# Altium schematic sheet ISL6236A_DEMO.SchDoc
size A3
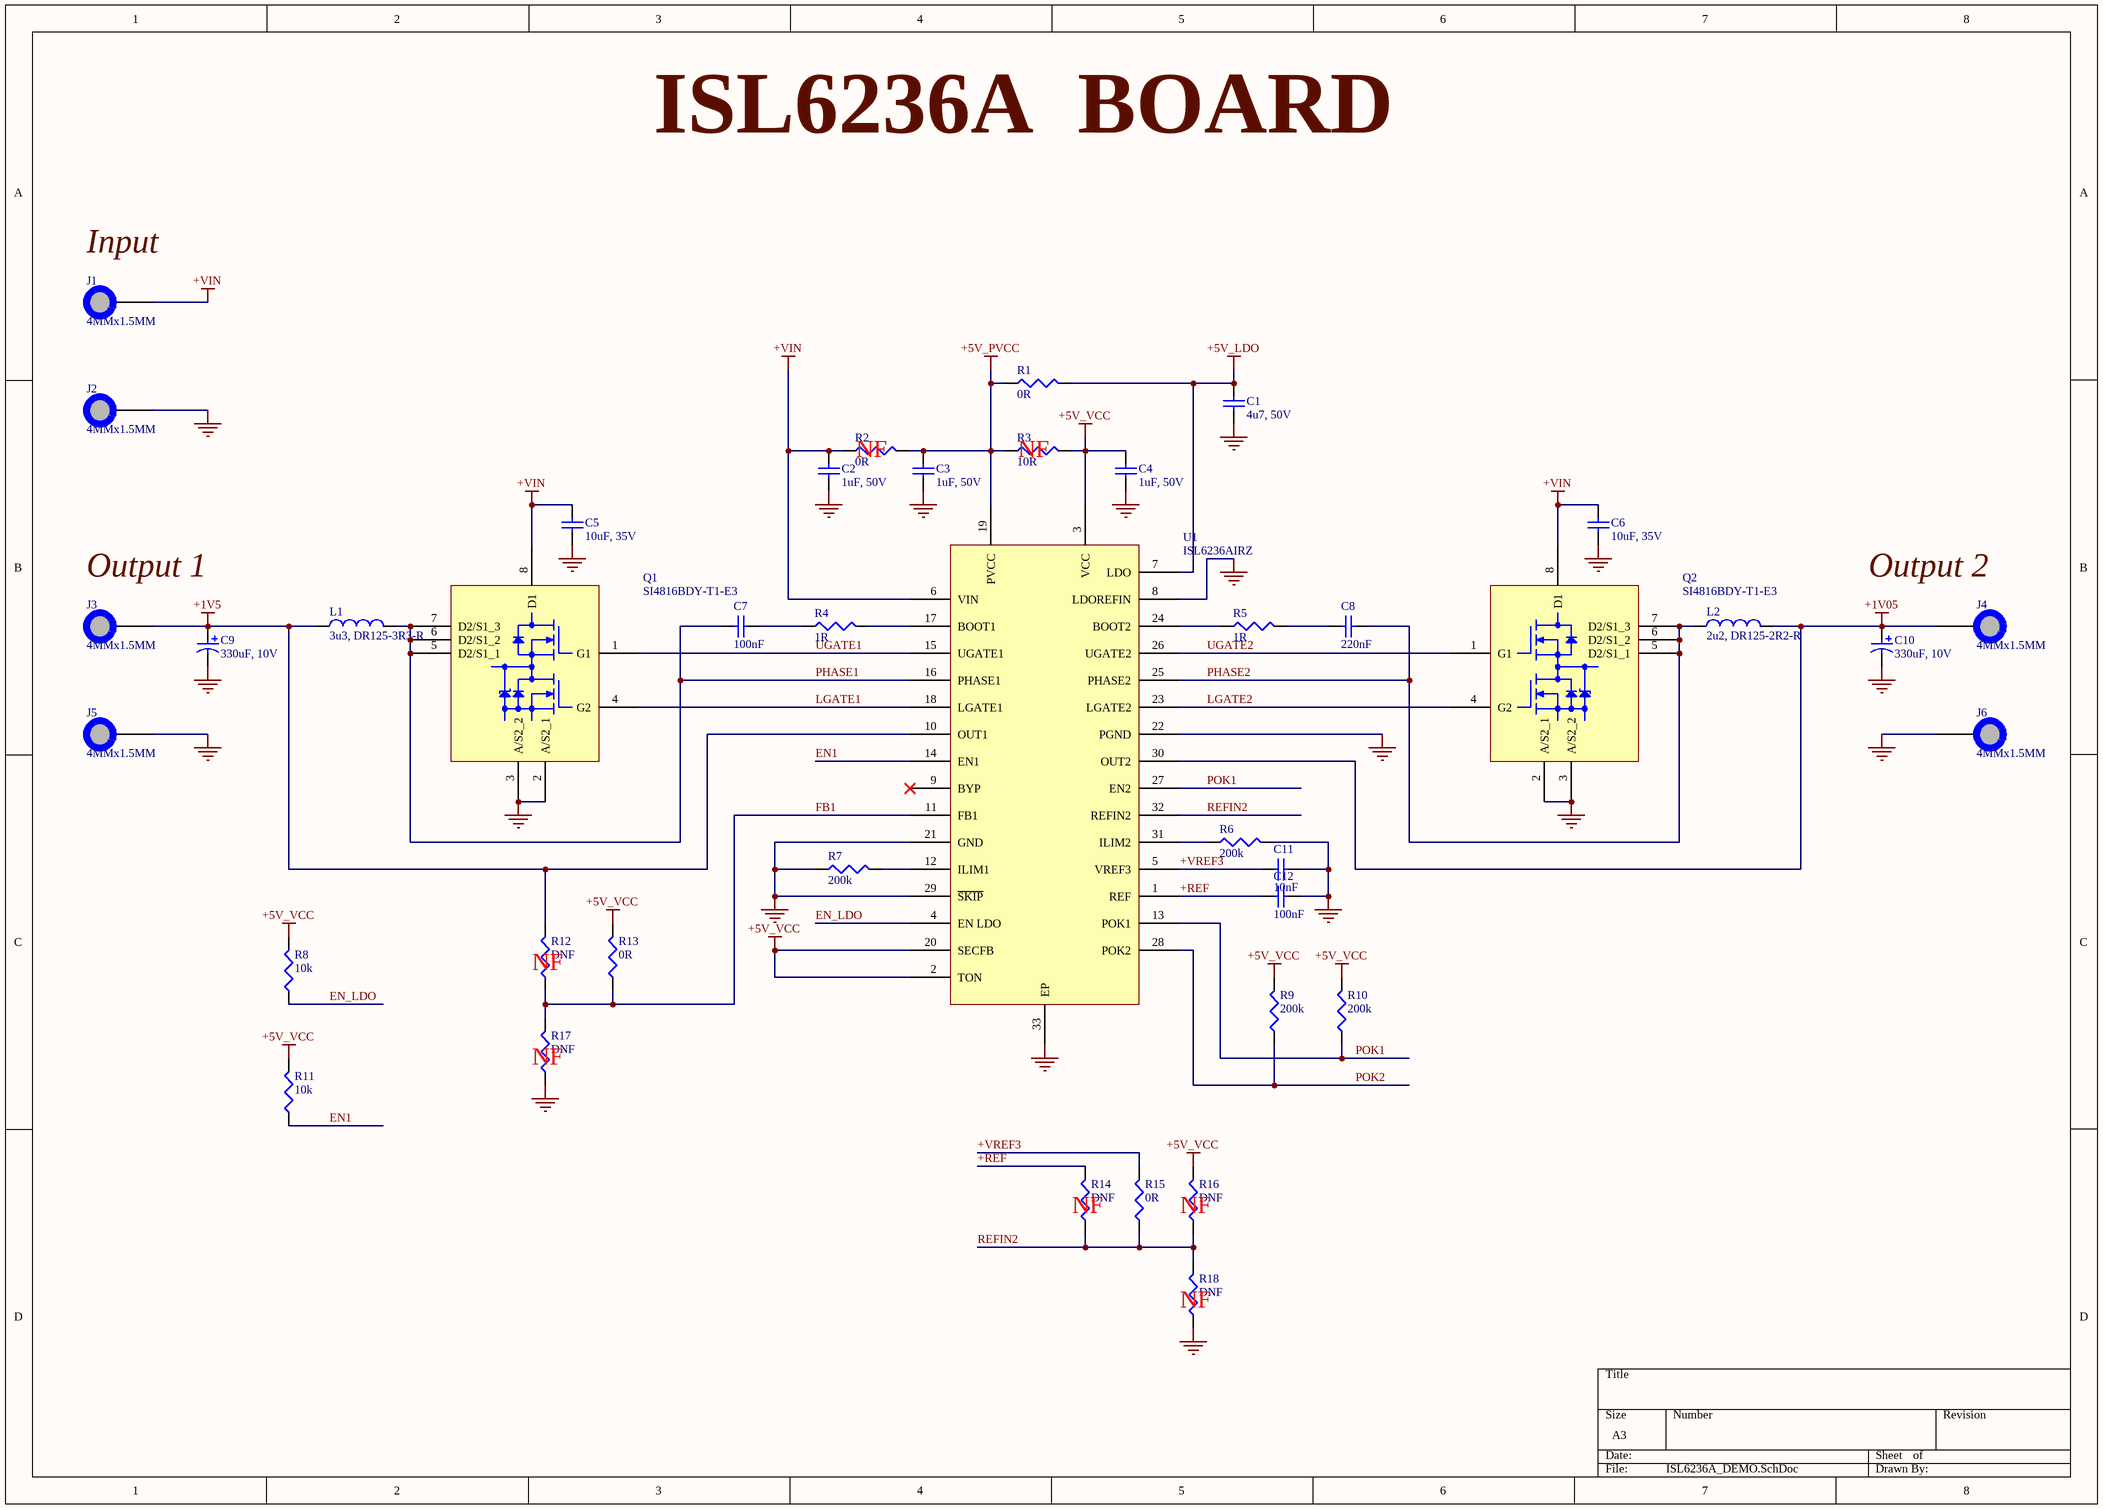
[diagram p0: ISL6236A_DEMO.SchDoc]

## Parts
C1  4u7, 50V  [C1206]
C2  1uF, 50V  [C0805]
C3  1uF, 50V  [C0805]
C4  1uF, 50V  [C0805]
C5  10uF, 35V  [C1210]
C6  10uF, 35V  [C1210]
C7  100nF  [C0805]
C8  220nF  [C0805]
C9  330uF, 10V  [7343-43]
C10  330uF, 10V  [7343-43]
C11  10nF  [C0805]
C12  100nF  [C0805]
J1  4MMx1.5MM  [PAD_WITH_HOLE_4MMx1MM5]
J2  4MMx1.5MM  [PAD_WITH_HOLE_4MMx1MM5]
J3  4MMx1.5MM  [PAD_WITH_HOLE_4MMx1MM5]
J4  4MMx1.5MM  [PAD_WITH_HOLE_4MMx1MM5]
J5  4MMx1.5MM  [PAD_WITH_HOLE_4MMx1MM5]
J6  4MMx1.5MM  [PAD_WITH_HOLE_4MMx1MM5]
L1  3u3, DR125-3R3-R  [DR125]
L2  2u2, DR125-2R2-R  [DR125]
Q1  SI4816BDY-T1-E3  [SO-8]
Q2  SI4816BDY-T1-E3  [SO-8]
R1  0R  [R0805]
R2  0R  [R0805]
R3  10R  [R0805]
R4  1R  [R0805]
R5  1R  [R0805]
R6  200k  [R0805]
R7  200k  [R0805]
R8  10k  [R0805]
R9  200k  [R0805]
R10  200k  [R0805]
R11  10k  [R0805]
R12  DNF  [R0805]
R13  0R  [R0805]
R14  DNF  [R0805]
R15  0R  [R0805]
R16  DNF  [R0805]
R17  DNF  [R0805]
R18  DNF  [R0805]
U1  ISL6236AIRZ  [L32.5x5B]

## Nets
+1V5: C9.1 J3.1 L1.1 R12.2 U1.10(OUT1)
+1V05: C10.1 J4.1 L2.2 U1.30(OUT2)
+5V_LDO: C1.2 R1.2 U1.7(LDO)
+5V_PVCC: C3.2 R1.1 R2.2 R3.1 U1.19(PVCC)
+5V_VCC: C4.2 R3.2 R8.2 R9.2 R10.2 R11.2 R13.2 R16.2 U1.2(TON) U1.3(VCC) U1.20(SECFB)
+VIN: C2.2 C5.2 C6.2 J1.1 Q1.8(D1) Q2.8(D1) R2.1 U1.6(VIN)
GND: C1.1 C2.1 C3.1 C4.1 C5.1 C6.1 C9.2 C10.2 C11.2 C12.2 J2.1 J5.1 J6.1 Q1.2(A/S2_1) Q1.3(A/S2_2) Q2.2(A/S2_1) Q2.3(A/S2_2) R6.2 R7.1 R17.1 R18.1 U1.8(LDOREFIN) U1.21(GND) U1.22(PGND) U1.29(~{SKIP}) U1.33(EP)
+REF: C12.1 R14.2 U1.1(REF)
+VREF3: C11.1 R15.2 U1.5(VREF3)
EN1: R11.1 U1.14(EN1)
EN_LDO: R8.1 U1.4(EN_LDO)
FB1: R12.1 R13.1 R17.2 U1.11(FB1)
LGATE1: Q1.4(G2) U1.18(LGATE1)
LGATE2: Q2.4(G2) U1.23(LGATE2)
PHASE1: C7.1 L1.2 Q1.5(D2/S1_1) Q1.6(D2/S1_2) Q1.7(D2/S1_3) U1.16(PHASE1)
PHASE2: C8.2 L2.1 Q2.5(D2/S1_1) Q2.6(D2/S1_2) Q2.7(D2/S1_3) U1.25(PHASE2)
POK1: R10.1 U1.13(POK1) U1.27(EN2)
POK2: R9.1 U1.28(POK2)
REFIN2: R14.1 R15.1 R16.1 R18.2 U1.32(REFIN2)
UGATE1: Q1.1(G1) U1.15(UGATE1)
UGATE2: Q2.1(G1) U1.26(UGATE2)
NetC7_2: C7.2 R4.1
NetC8_1: C8.1 R5.2
NetR4_2: R4.2 U1.17(BOOT1)
NetR5_1: R5.1 U1.24(BOOT2)
NetR6_1: R6.1 U1.31(ILIM2)
NetR7_2: R7.2 U1.12(ILIM1)

Not connected (* = marked no-connect by the designer): U1 9(BYP)*

## Notes on the sheet
- ISL6236A  BOARD
- (near J1) Input
- (near R2) NF
- (near R3) NF
- Output 1
- Output 2
- (near R12) NF
- (near R17) NF
- (near R14) NF
- (near R16) NF
- (near R18) NF

## Library data of the parts
C1 = C3216X5R1H475K160AB: CAP CER 4.7UF 50V X5R 1206; Manufacturer: TDK; Dielectric Material: Ceramic; Tolerance: 10%; Supplier 1: Digi-Key; Manufacturer Part Number: C3216X5R1H475K160AB; RoHS: Yes; Stock 1: 5017; Pricing 1: 1 = 1.02000, 10 = 0.75500, 100 = 0.51750, 500 = 0.40968, 1000 = 0.34500 (USD); Mount: Surface Mount; Case/Package: 1206; Weight: 0.000571oz; Case Code (Imperial): 1206; Case Code (Metric): 3216; Min Operating Temperature: -55°C; Max Operating Temperature: 85°C; Capacitance: 4.7uF; Packaging: Tape and Reel; Voltage Rating: 50V; Voltage Rating (DC): 50V; Package Quantity: 1; Dielectric: X5R; Termination: SMD/SMT; Composition: Ceramic; Length: 3.2mm; Height: 1.6mm; Width: 1.6mm; Thickness: 0.071inch; Depth: 1.6mm; Lead Free: Lead Free; ComponentLink1URL: http://www.mouser.com/ds/2/400/lcc_commercial_general_en-837201.pdf; ComponentLink1Description: http://www.mouser.com/ds/2/400/lcc_commercial_general_en-837201.pdf; ComponentLink2URL: https://product.tdk.com/en/products/common/pdf/mlcc_partnumber_description.pdf; ComponentLink2Description: https://product.tdk.com/en/products/common/pdf/mlcc_partnumber_description.pdf; ComponentLink3URL: https://product.tdk.com/info/en/documents/chara_sheet/C3216X5R1H475K160AB.pdf; ComponentLink3Description: https://product.tdk.com/info/en/documents/chara_sheet/C3216X5R1H475K160AB.pdf; Supplier Part Number 1: 445-5994-1-ND
C2-C4 = C0805C105K5RACTU: Multilayer Ceramic Capacitors MLCC - SMD/SMT 1uF 50 Volts 10% X7R; Manufacturer: KEMET; Supplier 1: Digi-Key; Manufacturer Part Number: C0805C105K5RACTU; RoHS: Yes; Stock 1: 58300; Pricing 1: 1 = 0.45000, 10 = 0.31500, 100 = 0.18890, 500 = 0.14166, 1000 = 0.11963 (USD); Mount: PCB,Surface Mount; Case/Package: 0805; Case Code (Metric): 2012; Case Code (Imperial): 0805; Contact Plating: Matte,Tin; Dielectric Material: Ceramic; Min Operating Temperature: -55°C; Max Operating Temperature: 125°C; Packaging: Tape and Reel; Capacitance: 1uF; Tolerance: 10%; Voltage Rating: 50V; Voltage Rating (DC): 50V; Package Quantity: 1; Dielectric: X7R; Termination: SMD/SMT; Voltage: 50V; Length: 2mm; Height: 1.25mm; Width: 0.049inch; Thickness: 0.055inch; Depth: 1.25mm; REACH SVHC: No SVHC; ComponentLink1URL: http://www.farnell.com/datasheets/1851736.pdf; ComponentLink1Description: http://www.farnell.com/datasheets/1851736.pdf; ComponentLink2URL: http://www.mouser.com/ds/2/212/KEM_C1002_X7R_SMD-1102033.pdf; ComponentLink2Description: http://www.mouser.com/ds/2/212/KEM_C1002_X7R_SMD-1102033.pdf; Supplier Part Number 1: 399-7409-1-ND
C5 C6 = C1210C106K6PACTU: 1210 C 10uF Ceramic Multilayer Capacitor,  35 VDC,  +85degC,  X5R Dielec,  +/-10%; Manufacturer: KEMET; Dissipation Factor: 2.5%; Tolerance: 10%; Supplier 1: Digi-Key; Manufacturer Part Number: C1210C106K6PACTU; RoHS: Yes; Stock 1: 752; Pricing 1: 1 = 0.93000, 10 = 0.68600, 100 = 0.47030, 500 = 0.37228, 1000 = 0.31350 (USD); Mount: Surface Mount; Case/Package: 1210; Case Code (Metric): 3225; Case Code (Imperial): 1210; Dielectric Material: Ceramic; Min Operating Temperature: -55°C; Max Operating Temperature: 85°C; Packaging: Tape and Reel; Capacitance: 10uF; Voltage Rating: 35V; Voltage: 35V; Dielectric: X5R; Termination: Solder; Voltage Rating (DC): 35V; Length: 0.126inch; Height: 1.9mm; Width: 0.098inch; Thickness: 0.083inch; Depth: 2.5mm; Lead Free: Lead Free; Supplier Part Number 1: 399-12070-1-ND
C7 C12 = C0805C104K5RAC7800: Multilayer Ceramic Capacitors MLCC - SMD/SMT 50volts 0.1uF X7R 10%; Manufacturer: KEMET; Voltage Rating (DC): 50V; Supplier 1: Digi-Key; Manufacturer Part Number: C0805C104K5RAC7800; RoHS: Yes; Stock 1: 310062; Pricing 1: 1 = 0.24000, 10 = 0.17300, 100 = 0.08130, 500 = 0.05700, 1000 = 0.04719 (USD); Mount: Surface Mount; Case/Package: 0805; Case Code (Imperial): 0805; Case Code (Metric): 2012; Min Operating Temperature: -55°C; Max Operating Temperature: 125°C; Packaging: Tape and Reel; Tolerance: 10%; Capacitance: 100nF; Dielectric: X7R; Termination: SMD/SMT; Voltage: 50V; Package Quantity: 4000; Voltage Rating: 50V; Length: 2mm; Height: 0.9mm; Width: 1.2mm; Lead Pitch: 0.75mm; Depth: 1.25mm; Radiation Hardening: No; ComponentLink1URL: http://www.mouser.com/ds/2/212/KEM_C1002_X7R_SMD-1102033.pdf; ComponentLink1Description: http://www.mouser.com/ds/2/212/KEM_C1002_X7R_SMD-1102033.pdf; ComponentLink2URL: https://www.distrelec.biz/Web/Downloads/_t/ds/KEM_C1002_X7R_SMD_eng_tds.pdf?mime=application%2Fpdf; ComponentLink2Description: https://www.distrelec.biz/Web/Downloads/_t/ds/KEM_C1002_X7R_SMD_eng_tds.pdf?mime=application%2Fpdf; Supplier Part Number 1: 399-1170-1-ND
C8 = C0805C224K5RACTU: CAP CER 0.22UF 50V X7R 0805; Manufacturer: KEMET; Dielectric Material: Ceramic; Tolerance: 10%; Dissipation Factor: 2.5%; Supplier 1: Digi-Key; Manufacturer Part Number: C0805C224K5RACTU; RoHS: Yes; Stock 1: 1343663; Pricing 1: 1 = 0.22000, 10 = 0.15800, 100 = 0.07440, 500 = 0.05220, 1000 = 0.04321 (USD); Mount: PCB,Surface Mount; Case/Package: 0805; Case Code (Metric): 2012; Case Code (Imperial): 0805; Min Operating Temperature: -55°C; Max Operating Temperature: 125°C; Package Quantity: 1; Capacitance: 220nF; Voltage Rating: 50V; Packaging: Tape and Reel; Voltage Rating (DC): 50V; Dielectric: X7R; Termination: SMD/SMT; Voltage: 50V; Length: 2mm; Height: 0.9mm; Width: 0.049inch; Thickness: 0.055inch; Lead Pitch: 0.75mm; Depth: 1.25mm; Radiation Hardening: No; REACH SVHC: No SVHC; ComponentLink1URL: http://www.kemet.com/kemet/web/homepage/kechome.nsf/vapubfiles/KEM_C1002_X7R_SMD.pdf/$file/KEM_C1002_X7R_SMD.pdf; ComponentLink1Description: http://www.kemet.com/kemet/web/homepage/kechome.nsf/vapubfiles/KEM_C1002_X7R_SMD.pdf/$file/KEM_C1002_X7R_SMD.pdf; ComponentLink2URL: https://www.verical.com/server-webapp/html/getDatasheet?partID=304413; ComponentLink2Description: https://www.verical.com/server-webapp/html/getDatasheet?partID=304413; ComponentLink3URL: http://www.farnell.com/datasheets/1851736.pdf; ComponentLink3Description: http://www.farnell.com/datasheets/1851736.pdf; ComponentLink4URL: https://search.kemet.com/component-edge/download/datasheet/C0805C224K5RACTU.pdf; ComponentLink4Description: https://search.kemet.com/component-edge/download/datasheet/C0805C224K5RACTU.pdf; Supplier Part Number 1: 399-3491-1-ND
C9 C10 = T530X337M010ATE004: Tantalum Capacitors - Polymer SMD 330uF 10volts 20%; Manufacturer: KEMET; Ripple Current: 8.2A; ESR (Equivalent Series Resistance): 4mR; Leakage Current: 330uA; Polarity: Polar; Dissipation Factor: 8%; Life (Hours): 2000Hour; Supplier 1: Digi-Key; Manufacturer Part Number: T530X337M010ATE004; RoHS: Yes; Pricing 1: 1 = 6.86000, 10 = 6.09500, 100 = 4.87600 (USD); Mount: PCB,Surface Mount; Case/Package: 2917; Case Code (Imperial): 2917; Case Code (Metric): 7343; Min Operating Temperature: -55°C; Max Operating Temperature: 125°C; Package Quantity: 500; Voltage Rating (DC): 10V; Capacitance: 330uF; Tolerance: 20%; Packaging: Tape and Reel; Voltage Rating: 10V; Termination: SMD/SMT; Voltage: 10V; Features: General Purpose; Length: 7.3mm; Height: 4mm; Width: 4.3mm; Height - Seated (Max): 0.169inch; Depth: 4.3mm; REACH SVHC: No SVHC; ComponentLink1URL: https://www.alliedelec.com/m/d/c2b5846d1b4015924ec44504ba06510b.pdf; ComponentLink1Description: https://www.alliedelec.com/m/d/c2b5846d1b4015924ec44504ba06510b.pdf; ComponentLink2URL: http://uk.rs-online.com/webdocs/1529/0900766b815291cb.pdf; ComponentLink2Description: http://uk.rs-online.com/webdocs/1529/0900766b815291cb.pdf; Supplier Part Number 1: 399-10378-1-ND
C11 = C0805F103K5RACTU: CAP CER 10000PF 50V X7R 0805; Manufacturer: KEMET; Dielectric Material: Ceramic; Tolerance: 10%; Supplier 1: Digi-Key; Manufacturer Part Number: C0805F103K5RACTU; RoHS: Yes; Stock 1: 75209; Pricing 1: 1 = 0.39000, 10 = 0.27000, 100 = 0.16190, 500 = 0.12142, 1000 = 0.10253 (USD); Mount: Surface Mount; Case/Package: 0805; Number of Pins: 2; Case Code (Imperial): 0805; Case Code (Metric): 2012; Min Operating Temperature: -55°C; Max Operating Temperature: 125°C; Capacitance: 10nF; Package Quantity: 4000; Voltage Rating: 50V; Voltage Rating (DC): 50V; Packaging: Cut Tape; Dielectric: X7R; Termination: SMD/SMT; Voltage: 50V; Length: 2mm; Height: 0.9mm; Width: 1.25mm; Lead Pitch: 0.75mm; Thickness: 0.039inch; Depth: 1.25mm; REACH SVHC: No SVHC; ComponentLink1URL: https://search.kemet.com/component-edge/download/datasheet/C0805F103K5RACTU.pdf; ComponentLink1Description: https://search.kemet.com/component-edge/download/datasheet/C0805F103K5RACTU.pdf; ComponentLink2URL: http://www.farnell.com/datasheets/2317279.pdf; ComponentLink2Description: http://www.farnell.com/datasheets/2317279.pdf; Supplier Part Number 1: 399-5107-1-ND
J1-J6 = PAD_WITH_HOLE_4MMx1MM5: Pad with a hole 4mm x 1.5mm
L1 = DR125-3R3-R: Inductor Power Shielded Drum Core 3.084uH/3.3uH 20% 100KHz Ferrite 9.26A 6.3mOhm DCR T/R; Manufacturer: Eaton Cooper; Saturation Current: 12.7A; Inductance: 3.3uh; DC Resistance (DCR): 6.3mR; Supplier 1: Digi-Key; Manufacturer Part Number: DR125-3R3-R; RoHS: Yes; Stock 1: 3434; Pricing 1: 1 = 2.03000, 10 = 1.87300, 100 = 1.31130 (USD); Mount: Surface Mount; Case/Package: Nonstandard; Number of Pins: 2; Core Material: Ferrite; Min Operating Temperature: -40°C; Max Operating Temperature: 125°C; Tolerance: 20%; Shielding: Shielded; Packaging: Tape and Reel; Inductance Tolerance: 20%; Package Quantity: 600; Test Frequency: 100kHz; Max DC Current: 9.26A; Termination: SMD/SMT; RMS Current (Irms): 9.26A; Self Resonant Frequency: 100kHz; Military Standard: Not; Current Rating: 9.26A; Composition: Wirewound; Length: 12.5mm; Height: 6mm; Width: 0.492inch; Depth: 12.5mm; Height - Seated (Max): 0.236inch; Radiation Hardening: No; REACH SVHC: No SVHC; ComponentLink1URL: http://uk.rs-online.com/webdocs/116a/0900766b8116a153.pdf; ComponentLink1Description: http://uk.rs-online.com/webdocs/116a/0900766b8116a153.pdf; ComponentLink2URL: https://www.verical.com/server-webapp/html/getDatasheet?partID=251124; ComponentLink2Description: https://www.verical.com/server-webapp/html/getDatasheet?partID=251124; ComponentLink3URL: http://www.farnell.com/datasheets/87246.pdf; ComponentLink3Description: http://www.farnell.com/datasheets/87246.pdf; ComponentLink4URL: http://www.cooperindustries.com/content/dam/public/bussmann/Electronics/Resources/product-datasheets/Bus_Elx_DS_4315_DR_Series.pdf; ComponentLink4Description: http://www.cooperindustries.com/content/dam/public/bussmann/Electronics/Resources/product-datasheets/Bus_Elx_DS_4315_DR_Series.pdf; ComponentLink5URL: http://www.onlinecomponents.com/productFiles/mf-COI/4a32919a-7470-4ae0-be45-b59e3a1351ef.pdf; ComponentLink5Description: http://www.onlinecomponents.com/productFiles/mf-COI/4a32919a-7470-4ae0-be45-b59e3a1351ef.pdf; Supplier Part Number 1: 513-1529-1-ND
L2 = DR125-2R2-R: Fixed Inductors 2.2uH 15A 0.0045ohms; Manufacturer: Eaton Cooper; Core Material: Ferrite; Current Rating: 10.9A; Tolerance: 20%; Shielding: Shielded; DC Resistance (DCR): 4.5mR; Test Frequency: 100kHz; Supplier 1: Digi-Key; Manufacturer Part Number: DR125-2R2-R; RoHS: Yes; Stock 1: 105; Pricing 1: 1 = 2.03000, 10 = 1.87300, 100 = 1.31130 (USD); Mount: Surface Mount; Case/Package: Nonstandard; Number of Pins: 2; Weight: 0.144oz; Min Operating Temperature: -40°C; Max Operating Temperature: 125°C; Package Quantity: 600; Saturation Current: 15A; Packaging: Tape and Reel; Inductance: 2.2uh; Inductance Tolerance: 20%; Composition: Wirewound; Max DC Current: 10.9A; Termination: SMD/SMT; Self Resonant Frequency: 100kHz; DC Current: 10.9A; Military Standard: Not; RMS Current (Irms): 10.9A; Length: 12.5mm; Height: 6mm; Width: 0.492inch; Height - Seated (Max): 0.236inch; Depth: 12.5mm; Radiation Hardening: No; REACH SVHC: No SVHC; Lead Free: Lead Free; ComponentLink1URL: https://www.verical.com/server-webapp/html/getDatasheet?partID=571249; ComponentLink1Description: https://www.verical.com/server-webapp/html/getDatasheet?partID=571249; ComponentLink2URL: http://uk.rs-online.com/webdocs/116a/0900766b8116a153.pdf; ComponentLink2Description: http://uk.rs-online.com/webdocs/116a/0900766b8116a153.pdf; ComponentLink3URL: http://www.farnell.com/datasheets/87246.pdf; ComponentLink3Description: http://www.farnell.com/datasheets/87246.pdf; Supplier Part Number 1: 513-1662-1-ND
Q1 Q2 = SI4816BDY-T1-E3: MOSFET 2N-CH 30V 5.8A 8-SOIC; Manufacturer: Vishay Siliconix; Nominal Vgs: 3V; Rise Time: 9ns; Rds On Max: 18.5mR; Number of Elements: 2; Continuous Drain Current (ID): 8.2A; Drain to Source Resistance: 11.5mR; Gate to Source Voltage (Vgs): 20V; Max Power Dissipation: 1.25W; Turn-Off Delay Time: 31ns; Turn-On Delay Time: 13ns; Threshold Voltage: 1V; Element Configuration: Single; FET Type: 2 N-Channel; Supplier 1: Digi-Key; Manufacturer Part Number: SI4816BDY-T1-E3; RoHS: Yes; Stock 1: 7400; Pricing 1: 1 = 1.86000, 10 = 1.68100, 100 = 1.35110, 500 = 1.05086, 1000 = 0.87071 (USD); Mount: Surface Mount; Case/Package: SO; Number of Pins: 8; Weight: 0.006596oz; Min Operating Temperature: -55°C; Max Operating Temperature: 150°C; Packaging: Tape and Reel; Package Quantity: 1; Drain to Source Voltage (Vdss): 30V; Fall Time: 9ns; Number of Channels: 2; On-State Resistance: 18.5mR; Length: 5mm; Height: 1.55mm; Width: 4mm; Radiation Hardening: No; REACH SVHC: Unknown; Lead Free: Lead Free; ComponentLink1URL: http://www.vishay.com/docs/73026/si4816bd.pdf; ComponentLink1Description: http://www.vishay.com/docs/73026/si4816bd.pdf; ComponentLink2URL: https://www.verical.com/server-webapp/html/getDatasheet?partID=99188; ComponentLink2Description: https://www.verical.com/server-webapp/html/getDatasheet?partID=99188; ComponentLink3URL: https://www.alliedelec.com/m/d/ccea3a815e37c52236fbabed3b2d7fee.pdf; ComponentLink3Description: https://www.alliedelec.com/m/d/ccea3a815e37c52236fbabed3b2d7fee.pdf; ComponentLink4URL: http://datasheet.iiic.cc/vishay_[siliconix]/SI4816BDY-T1-E3.pdf; ComponentLink4Description: http://datasheet.iiic.cc/vishay_[siliconix]/SI4816BDY-T1-E3.pdf; Supplier Part Number 1: SI4816BDY-T1-E3CT-ND
R1 R2 R13 R15 = AC0805JR-070RL: Thick Film Resistors - SMD 1/8W 0.0ohm 5%; Manufacturer: Yageo; Power Rating: 125mW; Voltage Rating: 150V; Resistance: 0mR; Temperature Coefficient: 200ppm/°C; Supplier 1: Digi-Key; Manufacturer Part Number: AC0805JR-070RL; RoHS: Yes; Stock 1: 291433; Pricing 1: 1 = 0.10000, 10 = 0.04500, 25 = 0.03240, 50 = 0.02480, 100 = 0.01820, 250 = 0.01392, 500 = 0.01112, 1000 = 0.00819 (USD); Case/Package: 0805; Case Code (Imperial): 0805; Case Code (Metric): 2012; Min Operating Temperature: -55°C; Max Operating Temperature: 155°C; Packaging: Tape and Reel; Tolerance: 5%; Composition: Thick Film; Termination: SMD/SMT; Number of Terminations: 2; Max Power Dissipation: 125mW; Features: Automotive AEC-Q200,Moisture Resistant; Length: 0.079inch; Height: 0.024inch; Width: 1.25mm; Lead Free: Lead Free; Supplier Part Number 1: YAG3755CT-ND
R3 = AC0805FR-0710RL: Thick Film Resistors - SMD 1/8W 10ohm 1%; Manufacturer: Yageo; Power Rating: 125mW; Voltage Rating: 150V; Temperature Coefficient: 200ppm/°C; Supplier 1: Digi-Key; Manufacturer Part Number: AC0805FR-0710RL; RoHS: Yes; Stock 1: 569278; Pricing 1: 1 = 0.10000, 10 = 0.09000, 100 = 0.03460, 1000 = 0.01522, 2500 = 0.01315 (USD); Case/Package: 0805; Case Code (Imperial): 0805; Case Code (Metric): 2012; Min Operating Temperature: -55°C; Max Operating Temperature: 155°C; Packaging: Tape and Reel; Resistance: 10R; Tolerance: 1%; Composition: Thick Film; Termination: SMD/SMT; Number of Terminations: 2; Military Standard: Not; Max Power Dissipation: 125mW; Features: Automotive AEC-Q200,Moisture Resistant; Length: 2mm; Height: 0.024inch; Width: 1.25mm; Depth: 1.25mm; Lead Free: Lead Free; Supplier Part Number 1: YAG3690CT-ND
R4 R5 = AC0805FR-071RL: Thick Film Resistors - SMD 1/8W 1ohm 1% AEC-Q200; Manufacturer: Yageo; Voltage Rating: 150V; Power Rating: 125mW; Temperature Coefficient: 200ppm/°C; Supplier 1: Digi-Key; Manufacturer Part Number: AC0805FR-071RL; RoHS: Yes; Stock 1: 34903; Pricing 1: 1 = 0.10000, 10 = 0.09000, 100 = 0.03460, 1000 = 0.01522, 2500 = 0.01315 (USD); Case/Package: 0805; Weight: 0.000194oz; Case Code (Imperial): 0805; Case Code (Metric): 2012; Min Operating Temperature: -55°C; Max Operating Temperature: 155°C; Packaging: Tape and Reel; Tolerance: 1%; Resistance: 1R; Composition: Thick Film; Number of Terminations: 2; Termination: SMD/SMT; Max Power Dissipation: 125mW; Features: Automotive AEC-Q200,Moisture Resistant; Length: 0.079inch; Height: 0.024inch; Width: 0.049inch; Lead Free: Lead Free; ComponentLink1URL: http://www.mouser.com/ds/2/447/yageodocoutput-1111992.pdf; ComponentLink1Description: http://www.mouser.com/ds/2/447/yageodocoutput-1111992.pdf; Supplier Part Number 1: YAG3705CT-ND
R6 R7 R9 R10 = AC0805FR-07200KL: Thick Film Resistors - SMD 1/8W 200K ohm 1%; Manufacturer: Yageo; Power Rating: 125mW; Resistance: 200kR; Voltage Rating: 150V; Temperature Coefficient: 100ppm/°C; Supplier 1: Digi-Key; Manufacturer Part Number: AC0805FR-07200KL; RoHS: Yes; Stock 1: 46086; Pricing 1: 1 = 0.10000, 10 = 0.05000, 100 = 0.02050, 1000 = 0.00921, 2500 = 0.00799 (USD); Case/Package: 0805; Case Code (Imperial): 0805; Case Code (Metric): 2012; Min Operating Temperature: -55°C; Max Operating Temperature: 155°C; Tolerance: 1%; Packaging: Tape and Reel; Composition: Thick Film; Number of Terminations: 2; Termination: SMD/SMT; Max Power Dissipation: 125mW; Features: Automotive AEC-Q200,Moisture Resistant; Length: 0.079inch; Height: 0.024inch; Width: 0.049inch; Lead Free: Lead Free; Supplier Part Number 1: YAG3706CT-ND
R8 R11 = AC0805FR-0710KL: RES SMD 10K OHM 1% 1/8W 0805; Manufacturer: Yageo; Resistance: 10kR; Power Rating: 125mW; Voltage Rating: 150V; Temperature Coefficient: 100ppm/°C; Supplier 1: Digi-Key; Manufacturer Part Number: AC0805FR-0710KL; RoHS: Yes; Stock 1: 802268; Pricing 1: 1 = 0.10000, 10 = 0.05000, 100 = 0.02050, 1000 = 0.00921, 2500 = 0.00799 (USD); Case/Package: 0805; Case Code (Metric): 2012; Case Code (Imperial): 0805; Min Operating Temperature: -55°C; Max Operating Temperature: 155°C; Packaging: Tape and Reel; Tolerance: 1%; Package Quantity: 1; Composition: Thick Film; Number of Terminations: 2; Termination: SMD/SMT; Military Standard: Not; Max Power Dissipation: 125mW; Features: Anti-Sulfur,Automotive AEC-Q200,Moisture Resistant; Length: 0.079inch; Height: 0.024inch; Width: 0.049inch; Depth: 1.25mm; Lead Free: Lead Free; ComponentLink1URL: http://www.yageo.com/NewPortal/yageodocoutput?fileName=/pdf/R-Chip/PYu-AC_51_RoHS_L_6.pdf; ComponentLink1Description: http://www.yageo.com/NewPortal/yageodocoutput?fileName=/pdf/R-Chip/PYu-AC_51_RoHS_L_6.pdf; Supplier Part Number 1: 311-10KLGCT-ND
R12 R14 R16-R18 = RES
U1 = ISL6236AIRZ: IC MAIN PWR CTRLR QUAD 32-QFN; Manufacturer: Intersil; Number of Outputs: 2; Output Current: 20A; Switching Frequency: 500kHz; Supplier 1: Digi-Key; Manufacturer Part Number: ISL6236AIRZ; RoHS: Yes; Pricing 1: 600 = 3.81800 (USD); Mount: Surface Mount; Case/Package: QFN; Min Operating Temperature: -40°C; Max Operating Temperature: 100°C; Packaging: Rail/Tube; Package Quantity: 60; Length: 5mm; Height: 0.95mm; Width: 5mm; Radiation Hardening: No; Lead Free: Lead Free; ComponentLink1URL: http://www.intersil.com/content/dam/Intersil/documents/isl6/isl6236a.pdf; ComponentLink1Description: http://www.intersil.com/content/dam/Intersil/documents/isl6/isl6236a.pdf; Supplier Part Number 1: ISL6236AIRZ-ND